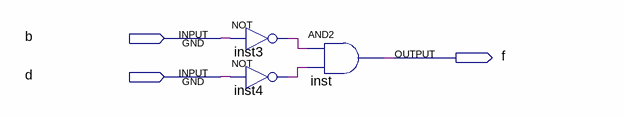
[diagram p0: schematic sheet]
// Quartus schematic 2-3-after.bdf as structural Verilog: 3 symbols, 3 pins
module \2-3-after  (
  input  b,
  input  d,
  output f
);

  wire inst3_out, inst4_out;

  not inst3 (inst3_out, b);
  not inst4 (inst4_out, d);
  and inst (f, inst3_out, inst4_out);
endmodule
